# EAGLE design main_board (EAGLE 9.6.2)
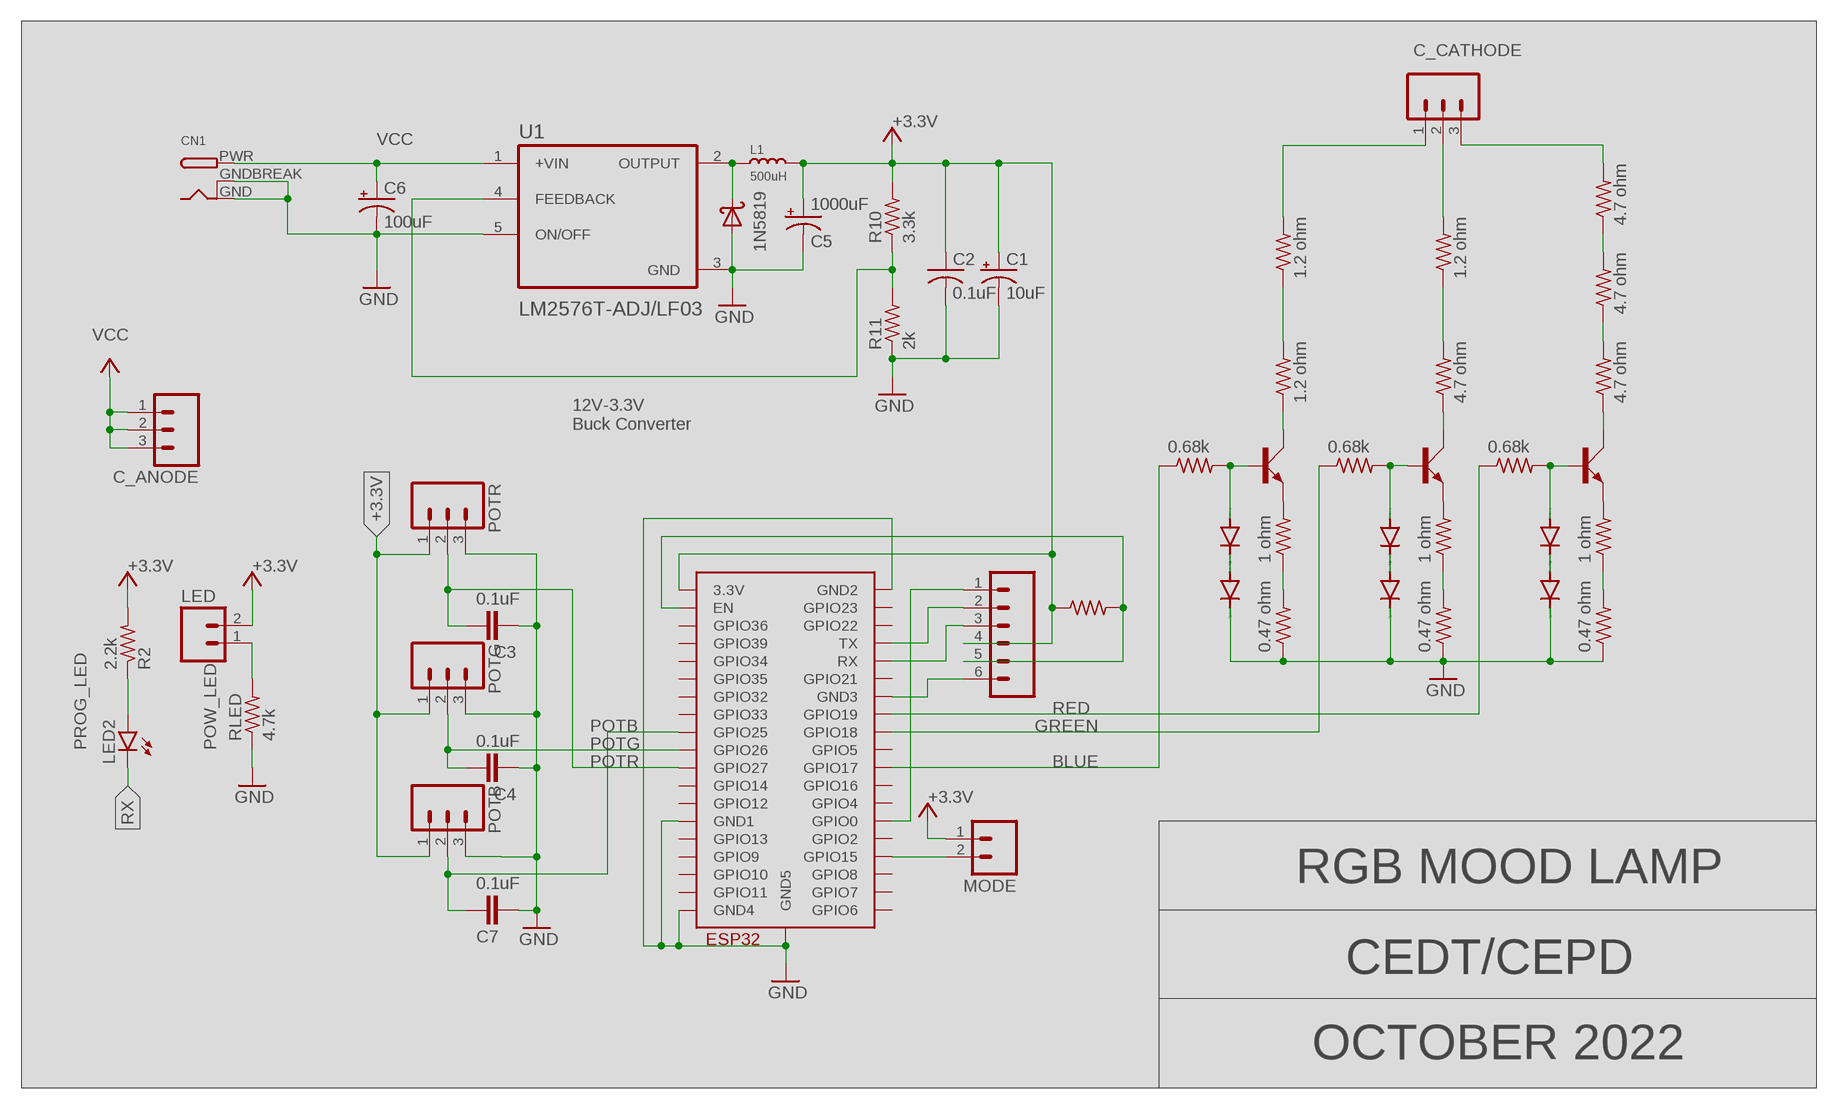
[diagram p0: schematic, sheet 1]

## Parts
C1  10uF  CAP_POL_16V  [B/3528-21R]
C2  0.1uF  CAP0603  [C0603]
C3  0.1uF  C2,5-3  [C2.5-3]
C4  0.1uF  C2,5-3  [C2.5-3]
C5  1000uF  CAPACITOR-PE3.5-8  [E3,5-8]
C6  100uF  CAPACITOR-PE3.5-8  [E3,5-8]
C7  0.1uF  C2,5-3  [C2.5-3]
C_ANODE  M03  [03P]
C_CATHODE  M03  [03P]
CN1  DCBARRELPTH  [DCJACK_2MM_PTH]
D11  1N5819  [DO41-10]
DB1  1N4004  [DO41-10]
DB2  1N4004  [DO41-10]
DG1  1N4004  [DO41-10]
DG2  1N4004  [DO41-10]
DR1  1N4004  [DO41-10]
DR2  1N4004  [DO41-10]
ESP32_MODULE  ESP32-WROOM  [ESP32-WROOM]
L1  500uH  INDUCTOR_INDUCTOR/FERRITE-BEAD6X8H  [INDUCTOR_INT2-3.5-D6.5XH8.0MM]
LED  M02  [02P]
LED2  LED-RED0603  [0603-RED]
MODE  M02  [02P]
POTB  M03  [03P]
POTG  M03  [03P]
POTR  M03  [03P]
QB  MJE3055  [TO220AV]
QG  MJE3055  [TO220AV]
QR  MJE3055  [TO220AV]
R1  10k  RESISTOR0805  [R0805]
R2  2.2k  RESISTOR0805  [R0805]
R10  3.3k  RESISTOR0207/7  [0207/7]
R11  2k  RESISTOR0207/7  [0207/7]
RB_B  0.68k  RESISTOR0207/7  [0207/7]
RB_G  0.68k  RESISTOR0207/7  [0207/7]
RB_R  0.68k  RESISTOR0207/7  [0207/7]
RC_B  1.2 ohm  RESISTOR0207/10  [0207/15]
RC_B1  1.2 ohm  RESISTOR0207/10  [0207/15]
RC_G  1.2 ohm  RESISTOR0207/10  [0207/15]
RC_G1  4.7 ohm  RESISTOR0207/10  [0207/15]
RC_R  4.7 ohm  RESISTOR0207/10  [0207/15]
RC_R1  4.7 ohm  RESISTOR0207/10  [0207/15]
RC_R2  4.7 ohm  RESISTOR0207/10  [0207/15]
RE_B  1 ohm  RESISTOR0207/10  [0207/15]
RE_B1  0.47 ohm  RESISTOR0207/10  [0207/15]
RE_G  1 ohm  RESISTOR0207/10  [0207/15]
RE_G1  0.47 ohm  RESISTOR0207/10  [0207/15]
RE_R  1 ohm  RESISTOR0207/10  [0207/15]
RE_R1  0.47 ohm  RESISTOR0207/10  [0207/15]
RLED  4.7k  RESISTOR0207/7  [0207/7]
SL2  M06  [06P]
U1  LM2576T-ADJ/LF03  [TO170P1016X470X2092-5]

## Nets
+3.3V: C1.+ C2.1 C5.+ ESP32_MODULE.3V3(3.3V) L1.2 LED.2 MODE.1 POTB.1 POTG.1 POTR.1 R1.1 R2.2 R10.2 SL2.4 ; supply symbol labelled VCC
BLUE: ESP32_MODULE.IO17(GPIO17) RB_B.1
ENABLE: ESP32_MODULE.EN R1.2 SL2.5
FB: R10.1 R11.2 U1.4(FEEDBACK)
GND: C1.- C2.2 C3.1 C4.1 C5.- C6.- C7.1 CN1.GND CN1.GNDBREAK D11.A DB2.C DG2.C DR2.C ESP32_MODULE.GND1 ESP32_MODULE.GND2 ESP32_MODULE.GND3 ESP32_MODULE.GND4 ESP32_MODULE.GND5 POTB.3 POTG.3 POTR.3 R11.1 RE_B1.1 RE_G1.1 RE_R1.1 RLED.1 SL2.6 U1.3(GND) U1.5(ON/OFF)
GREEN: ESP32_MODULE.IO18(GPIO18) RB_G.1
MODE: ESP32_MODULE.IO15(GPIO15) MODE.2
N$1: DB1.A QB.B RB_B.2
N$2: QB.E RE_B.2
N$3: C_CATHODE.3 RC_R.2
N$4: LED2.A R2.1
N$5: QG.E RE_G.2
N$6: QR.E RE_R.2
N$7: ESP32_MODULE.IO0(GPIO0) SL2.1
N$13: C_CATHODE.1 RC_B.2
N$14: C_CATHODE.2 RC_G.2
N$17: QB.C RC_B1.1
N$18: RE_B1.2 RE_B.1
N$19: RE_G1.2 RE_G.1
N$20: RC_G1.2 RC_G.1
N$21: RE_R1.2 RE_R.1
N$22: DR1.C DR2.A
N$23: DR1.A QR.B RB_R.2
N$24: LED.1 RLED.2
N$25: DG1.A QG.B RB_G.2
N$26: RC_B1.2 RC_B.1
N$27: DG1.C DG2.A
N$29: RC_R1.2 RC_R.1
N$30: RC_R1.1 RC_R2.2
N$31: QG.C RC_G1.1
N$32: QR.C RC_R2.1
N$33: DB1.C DB2.A
O/P: D11.C L1.1 U1.2(OUTPUT)
POTB: C7.2 ESP32_MODULE.IO25(GPIO25) POTB.2
POTG: C4.2 ESP32_MODULE.IO26(GPIO26) POTG.2
POTR: C3.2 ESP32_MODULE.IO27(GPIO27) POTR.2
RED: ESP32_MODULE.IO19(GPIO19) RB_R.1
RX: ESP32_MODULE.RX LED2.C SL2.3
TX: ESP32_MODULE.TX SL2.2
VCC [POWER]: C6.+ C_ANODE.1 C_ANODE.2 C_ANODE.3 CN1.PWR U1.1(+VIN) ; supply symbol labelled 12V
Unconnected: ESP32_MODULE.CLK(GPIO6) ESP32_MODULE.CMD(GPIO11) ESP32_MODULE.IO2(GPIO2) ESP32_MODULE.IO4(GPIO4) ESP32_MODULE.IO5(GPIO5) ESP32_MODULE.IO12(GPIO12) ESP32_MODULE.IO13(GPIO13) ESP32_MODULE.IO14(GPIO14) ESP32_MODULE.IO16(GPIO16) ESP32_MODULE.IO21(GPIO21) ESP32_MODULE.IO22(GPIO22) ESP32_MODULE.IO23(GPIO23) ESP32_MODULE.IO32(GPIO32) ESP32_MODULE.IO33(GPIO33) ESP32_MODULE.IO34(GPIO34) ESP32_MODULE.IO35(GPIO35) ESP32_MODULE.SD0(GPIO7) ESP32_MODULE.SD1(GPIO8) ESP32_MODULE.SD2(GPIO9) ESP32_MODULE.SD3(GPIO10) ESP32_MODULE.SENSOR_VN(GPIO39) ESP32_MODULE.SENSOR_VP(GPIO36)

## Notes on the sheet
- 12V-3.3V
  Buck Converter
- PROG_LED | POW_LED
- RGB MOOD LAMP
- CEDT/CEPD
- OCTOBER 2022

## Library data of the parts
C1 = CEDT_JANUARY_2015_v6:CAP_POL
C2 = CEDT_JANUARY_2015_v6:CAP
C3 C4 C7 = capacitor-wima:C: CAPACITOR naming: grid - package width
C5 C6 = BeagleBone_Blue_R3:CAPACITOR-P: POLARIZED CAPACITOR, American symbol
C_ANODE C_CATHODE POTB POTG POTR = con-amp-quick:M03: AMP QUICK CONNECTOR; OC_FARNELL: unknown; OC_NEWARK: unknown
CN1 = adafruit:DCBARREL: 2.0mm DC Barrel Jack DCJACK_2MM_PTH - Through Hole Jack (4UConnector: 05537)
D11 = CEDT_JANUARY_2015_v6:1N5819: DIODE general purpose rectifier, 1 A
DB1 DB2 DG1 DG2 DR1 DR2 = diode:1N4004: DIODE general purpose rectifier, 1 A
ESP32_MODULE = ESP32:ESP32-WROOM
L1 = BeagleBone_Blue_R3:INDUCTOR_INDUCTOR/FERRITE-BEAD
LED MODE = CEDT_JANUARY_2015_v6:M02: AMP QUICK CONNECTOR
LED2 = BeagleBone_Blue_R3:LED-RED
QB QG QR = transistor-power:MJE3055: NPN TRANSISTOR
R1 R2 R10 R11 RB_B RB_G RB_R RC_B RC_B1 RC_G RC_G1 RC_R RC_R1 RC_R2 RE_B RE_B1 RE_G RE_G1 RE_R RE_R1 RLED = CEDT_JANUARY_2015_v6:RESISTOR
SL2 = con-amp-quick:M06: AMP QUICK CONNECTOR; OC_FARNELL: unknown; OC_NEWARK: unknown
U1 = LM2576T-ADJ_LF03:LM2576T-ADJ/LF03: None Check availability <https://pricing.snapeda.com/parts/LM2576T-ADJ/LF03/Texas%20Instruments/view-part?ref=eda>; AVAILABILITY: In Stock; DESCRIPTION: SIMPLE SWITCHER&reg; 40V, 3A Low Component Count Step-Down Regulator; MF: Texas Instruments; MP: LM2576T-ADJ/LF03; PACKAGE: TO-220-5 Texas Instruments; PRICE: None; PURCHASE-URL: https://pricing.snapeda.com/search/part/LM2576T-ADJ/LF03/?ref=eda

## Net classes
1 POWER: width 0.711 mm, drill 0.7 mm, clearance 0.25 mm

## Board
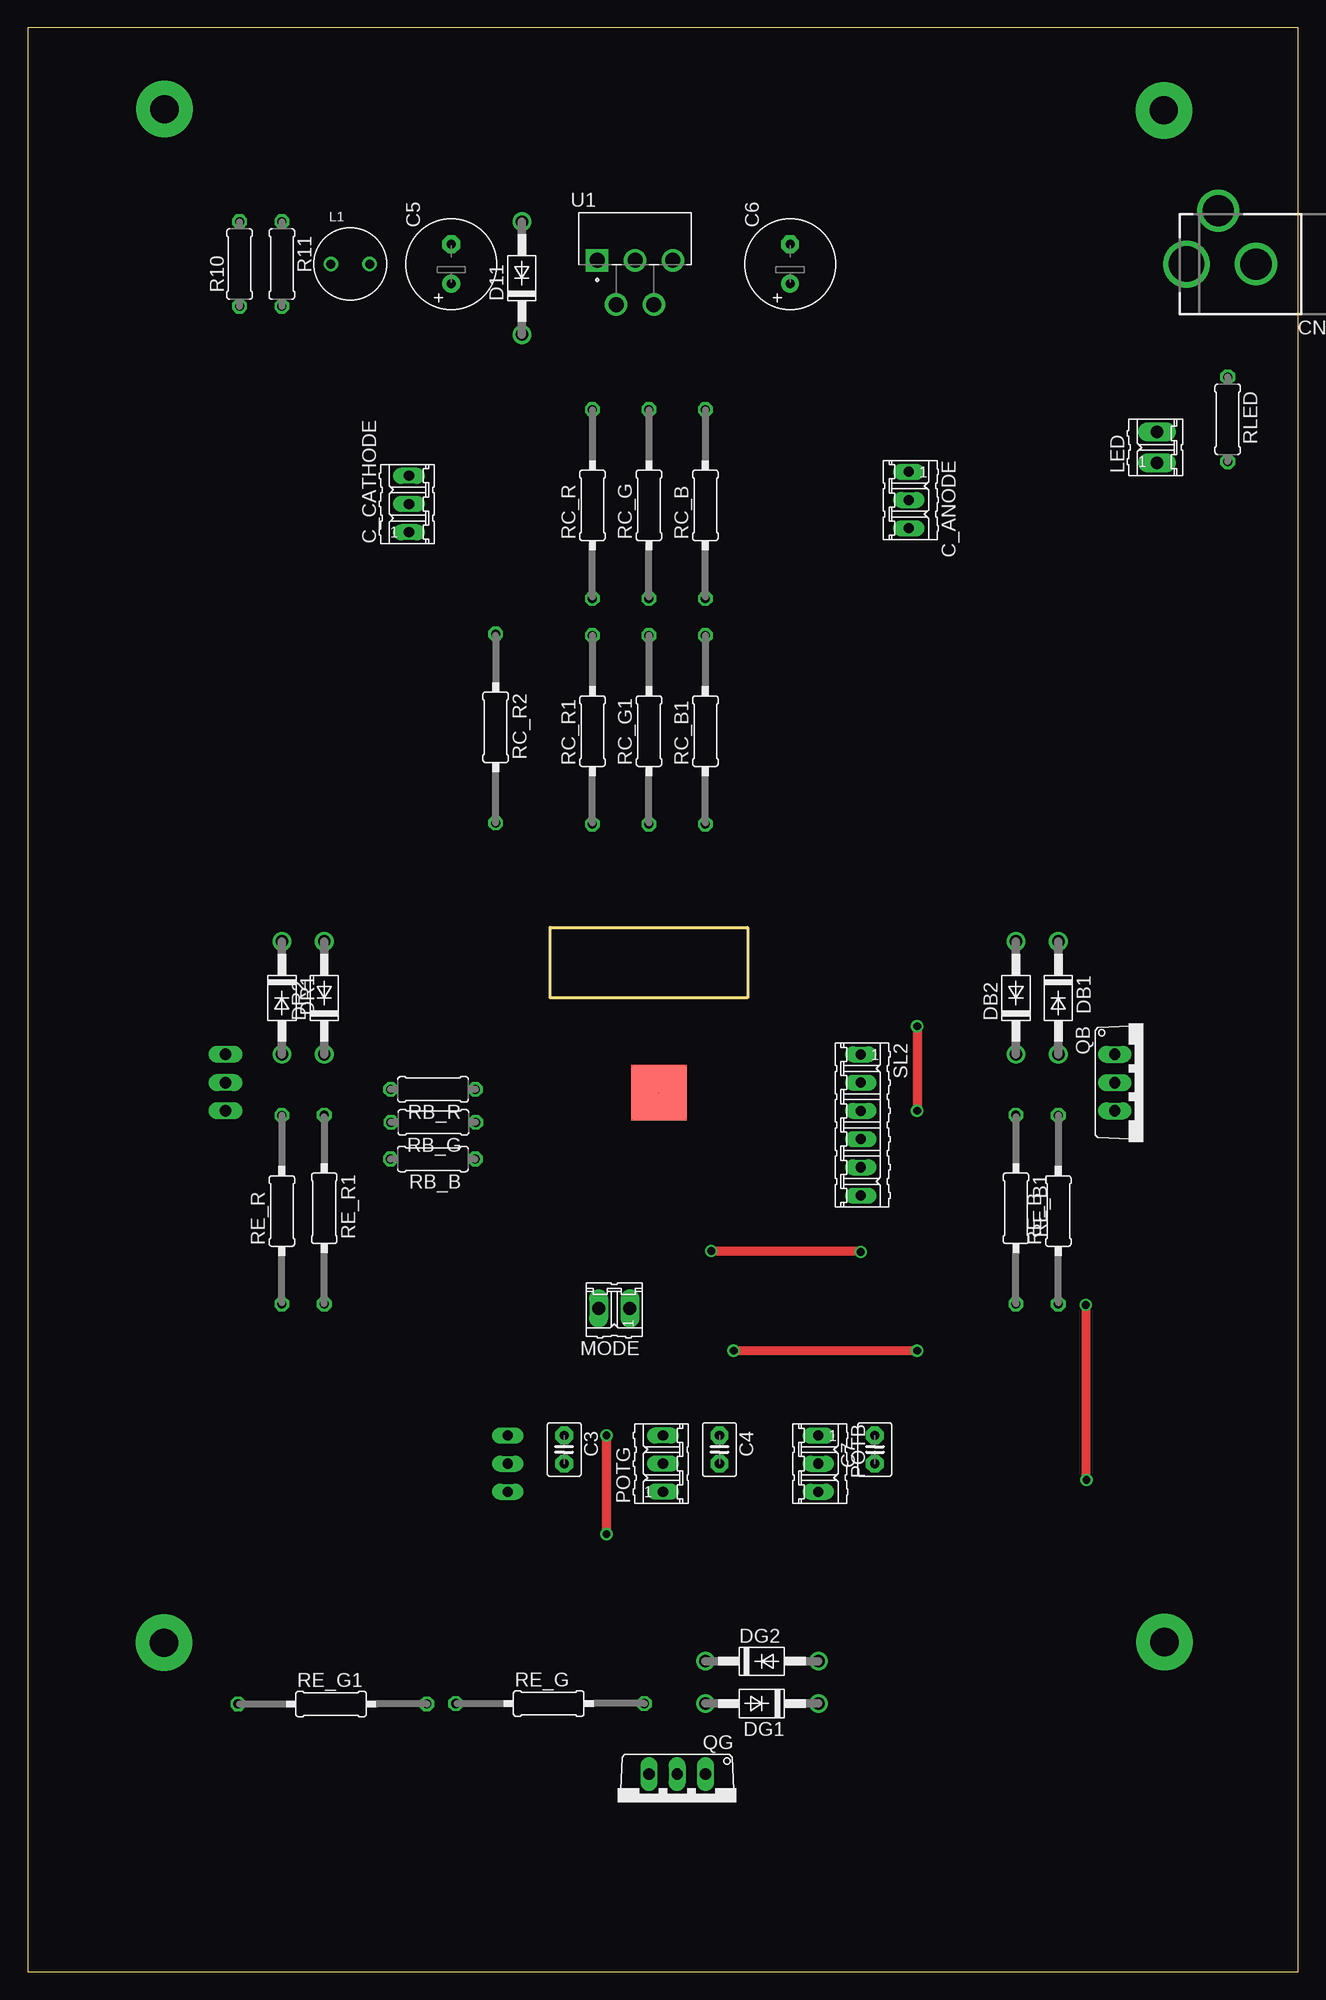
[diagram p1: board, top side]
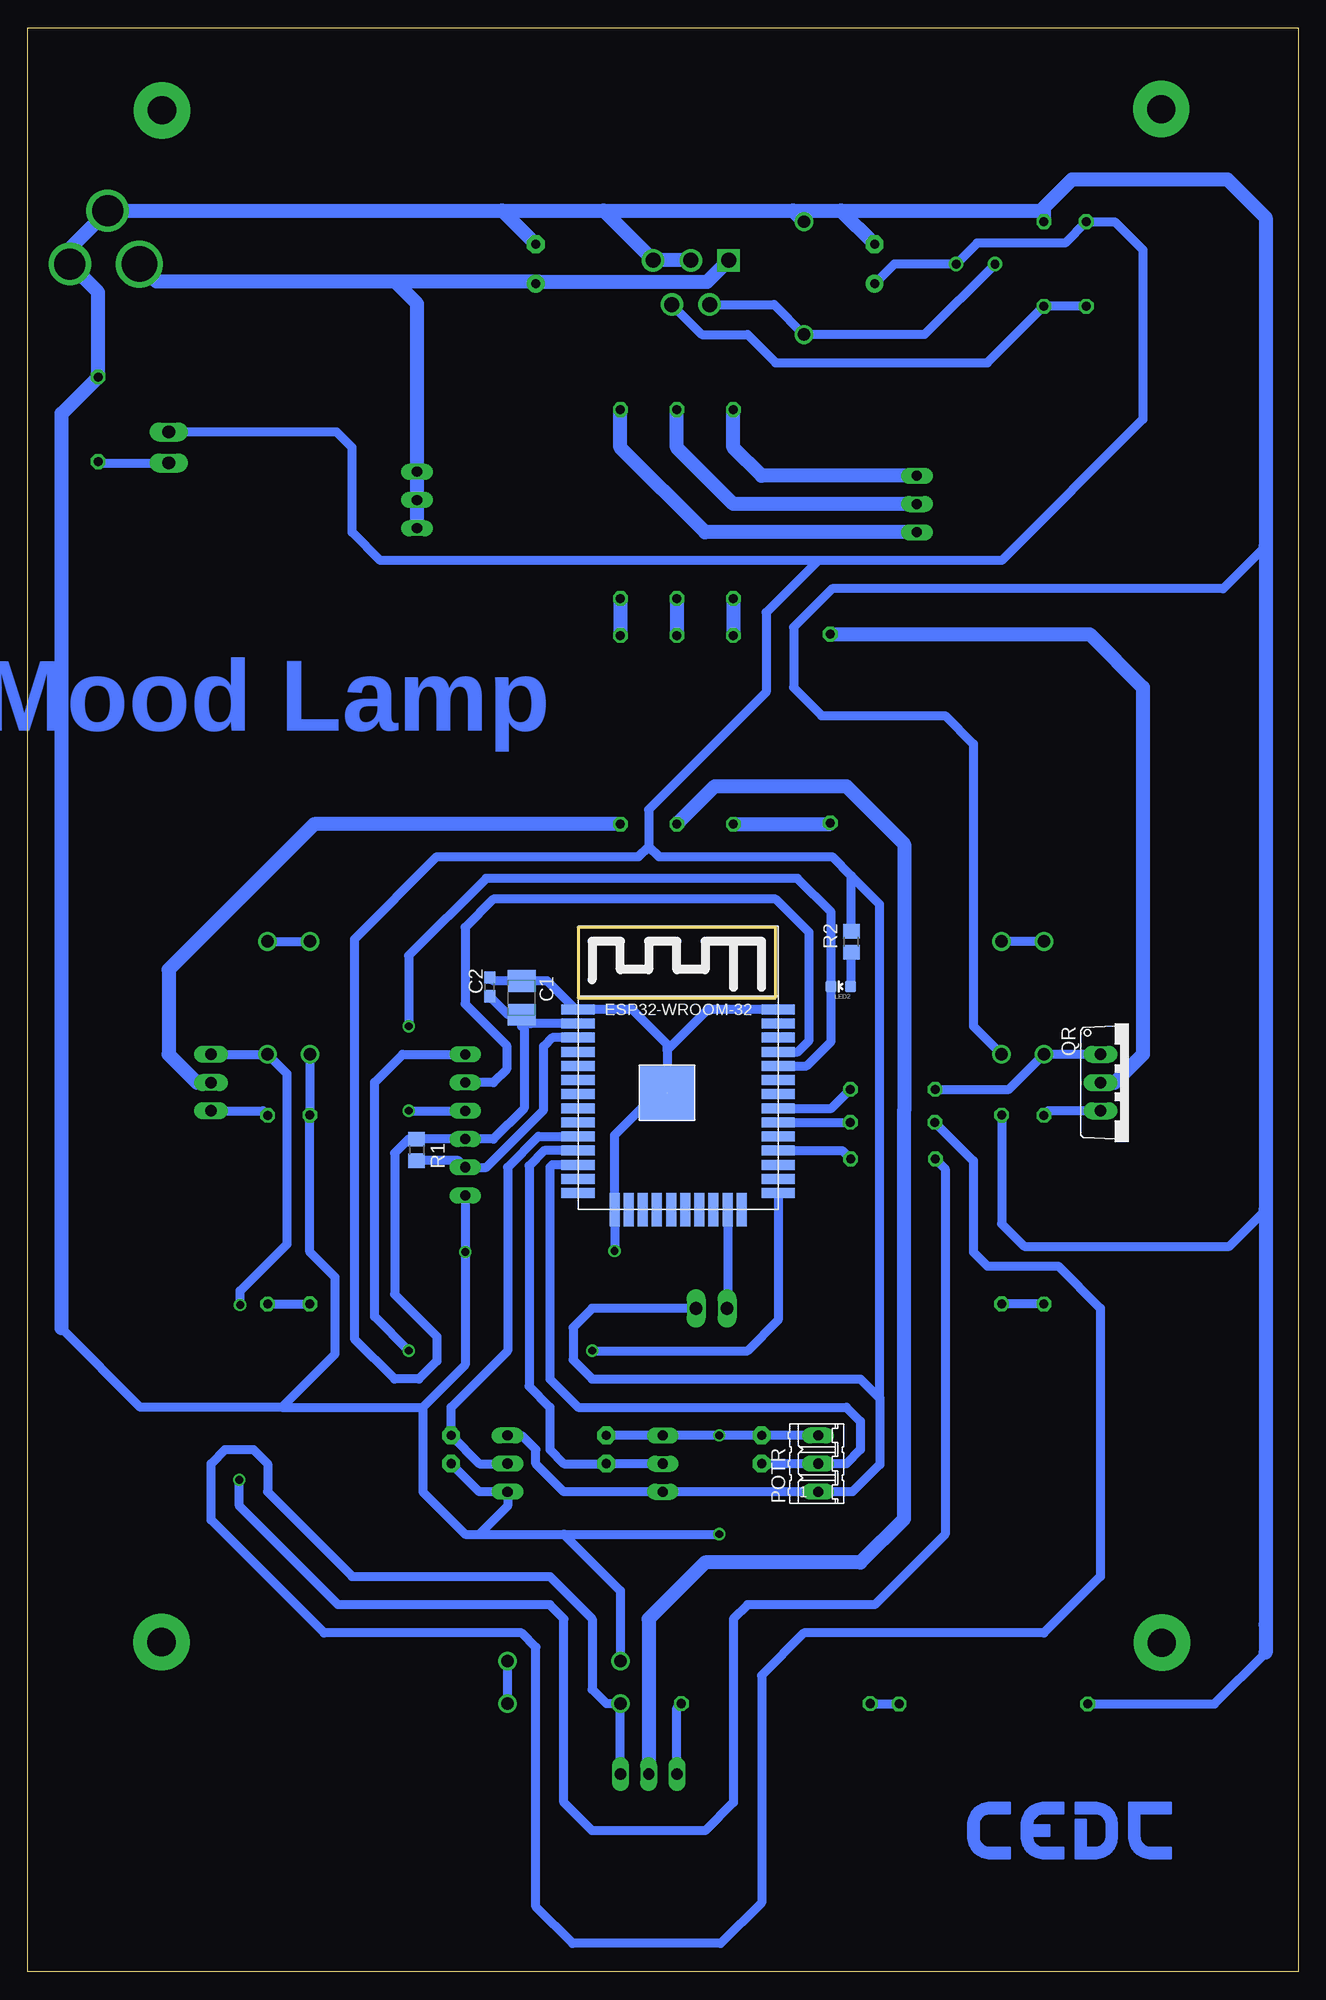
[diagram p2: board, bottom side, seen from below]

Size 114.28 x 174.93 mm. Coordinates in mm from the lower left corner, seen from the top.
Outline: 0,0 114.28,0 114.28,174.93 0,174.93 0,0
Outline: 46.99,93.98 64.77,93.98 64.77,87.63 46.99,87.63 46.99,93.98
Copper layers (1*16): Top 0.035mm / dielectric 1.5mm / Bottom 0.035mm
Design rules "default *": minimum track width 6mil, minimum drill 0.35mm, track to track 12mil, track to pad 12mil, pad to pad 12mil, via to via 12mil, smd to smd 12mil, copper to edge 40mil, drill to drill 6mil, minimum pad ring 10mil, minimum via ring 8mil, stop-mask expansion 4mil, vias tented up to drill 0mil, thermal gap 10mil

### Footprints (pad centres in the part's own frame; a part is rotated, then mirrored left to right if it is on the bottom)
B/3528-21R = smd 1.95 x 2.5: + 1.525,0; - -1.525,0
C0603 = smd 1.1 x 1: 1 -0.85,0; 2 0.85,0
C2.5-3 = drill 0.813 pad 1.6 octagon: 1 -1.27,0; 2 1.27,0
E3,5-8 = drill 0.813 pad 1.6: + -1.778,0 | drill 0.813 pad 1.6 octagon: - 1.778,0
03P = drill 0.914 long: 1 -2.54,0; 2 0,0; 3 2.54,0
DCJACK_2MM_PTH = drill 2.8: GND 0,7.35; GNDBREAK 4.8,10.75 | drill 3.2: PWR 0,13.6
DO41-10 = drill 1.118: A 5.08,0; C -5.08,0
ESP32-WROOM = smd 3 x 0.9: 3V3 0,16.74; EN 0,15.47; GND1 0,18.01; GND3 18,18.01; IO0 18,1.5; IO4 18,2.77; IO5 18,6.58; IO12 0,1.5; IO14 0,2.77; IO16 18,4.04; IO17 18,5.31; IO18 18,7.85; IO19 18,9.12; IO21 18,11.66; IO22 18,15.47; IO23 18,16.74; IO25 0,6.58; IO26 0,5.31; IO27 0,4.04; IO32 0,9.12; IO33 0,7.85; IO34 0,11.66; IO35 0,10.39; NC 18,10.39; RX 18,12.93; SENSOR_VN 0,12.93; SENSOR_VP 0,14.2; TX 18,14.2 | smd 0.9 x 3: CLK 9.635,0; CMD 8.365,0; GND2 3.285,0; IO2 14.715,0; IO13 4.555,0; IO15 13.445,0; SD0 10.905,0; SD1 12.175,0; SD2 5.825,0; SD3 7.095,0 | smd 5 x 5: GND4 8,10.5 | smd 5 x 5 bottom: GND5 8,10.5
INDUCTOR_INT2-3.5-D6.5XH8.0MM = drill 0.8: 1 -1.75,0; 2 1.75,0
02P = drill 1.143 long: 1 -1.397,0; 2 1.397,0
0603-RED = smd 1 x 1: A 0,-0.877; C 0,0.877
TO220AV = drill 1.016 long: B -2.54,-2.54; C 0,-2.54; E 2.54,-2.54
R0805 = smd 1.3 x 1.5: 1 -0.95,0; 2 0.95,0
0207/7 = drill 0.813 octagon: 1 -3.81,0; 2 3.81,0
0207/15 = drill 0.813 octagon: 1 -8.5,0; 2 8.486,0
06P = drill 0.914 long: 1 -6.35,0; 2 -3.81,0; 3 -1.27,0; 4 1.27,0; 5 3.81,0; 6 6.35,0
TO170P1016X470X2092-5 = drill 1.35 square: 1 0,0 | drill 1.35: 2 1.7,-4; 3 3.4,0; 4 5.1,-4; 5 6.8,0

### Placement (x,y rotation side)
C1  69.85,87.63 270 bottom
C2  72.71,88.63 90 bottom
C3  48.26,46.99 270 top
C4  62.23,46.99 270 top
C5  38.1,153.67 90 top
C6  68.58,153.67 90 top
C7  76.2,46.99 90 top
C_ANODE  79.26,132.43 270 top
C_CATHODE  34.29,132.08 90 top
CN1  117.85,153.67 90 top
D11  44.45,152.4 90 top
DB1  92.71,87.63 270 top
DB2  88.9,87.63 90 top
DG1  66.04,24.13 180 top
DG2  66.04,27.94 0 top
DR1  22.86,87.63 270 top
DR2  26.67,87.63 90 top
ESP32_MODULE  64.77,68.58 0 bottom
L1  29.01,153.67 0 top
LED  101.6,137.16 90 top
LED2  41.14,88.67 90 bottom
MODE  52.76,59.69 180 top
POTB  71.12,45.72 270 top
POTG  57.15,45.72 90 top
POTR  43.18,45.72 90 bottom
QB  100.33,80.01 270 top
QG  58.42,15.24 180 top
QR  15.24,80.01 270 bottom
R1  79.3,73.95 270 bottom
R2  40.18,92.69 90 bottom
R10  19.05,153.67 90 top
R11  22.86,153.67 270 top
RB_B  36.44,73.13 180 top
RB_G  36.48,76.43 180 top
RB_R  36.46,79.4 180 top
RC_B  60.96,132.08 90 top
RC_B1  60.96,111.76 90 top
RC_G  55.88,132.08 90 top
RC_G1  55.88,111.76 90 top
RC_R  50.8,132.08 90 top
RC_R1  50.8,111.76 90 top
RC_R2  42.09,111.86 270 top
RE_B  92.71,68.58 90 top
RE_B1  88.9,68.58 270 top
RE_G  46.99,24.13 0 top
RE_G1  27.41,24.09 0 top
RE_R  22.86,68.58 90 top
RE_R1  26.67,68.58 270 top
RLED  107.95,139.7 270 top
SL2  74.93,76.2 270 top
U1  51.23,154.01 0 top
U$1  [LOGO-CEDT-BOT-18MM]  11.43,10.16 0 top

### Tracks (layer width: path | path; a pad name or v marks a point on that pad's centre or on a via)
+3.3V
  Bottom 0.813: C5.+ 36.32,153.67 L1.2 28.86,155.57 20.96,155.57 R10.2 16.51,157.48 13.97,154.94 13.97,139.7 26.67,127 43.18,127 | ESP32_MODULE.3V3 69.06,85.32 C1.+ | C1.+ 71.04,86.11 C2.1 | 43.18,127 82.55,127 85.09,129.54 85.09,137.16 86.49,138.56 LED.2 | MODE.1 63.5,59.69 65.22,57.97 65.22,55.07 63.5,53.34 39.37,53.34 37.66,51.63 | 37.66,51.63 37.63,51.6 37.63,45.65 40.1,43.18 POTR.1 POTG.1 66.04,43.18 68.58,45.72 68.58,46.99 69.85,48.26 POTB.1 | C1.+ 69.85,85.09 69.62,84.86 69.62,77.7 72.39,74.93 SL2.4 79.27,74.93 R1.1 80.04,74.9 81.28,73.66 81.28,60.96 77.47,57.15 77.47,54.96 79.09,53.34 81.28,53.34 84.9,56.96 84.9,92.9 77.47,100.33 59.35,100.33 58.42,101.26 | 43.18,127 47.86,122.32 47.86,115.13 58.42,104.57 58.42,101.26 | 37.66,51.63 37.66,96.08 40.18,98.6 | 40.18,98.6 41.91,100.33 57.49,100.33 58.42,101.26 | R2.2 40.18,98.6
BLUE
  Bottom 0.813: ESP32_MODULE.IO17 41.01,73.89 RB_B.1
ENABLE
  Bottom 0.813: R1.2 75.54,73 SL2.5 73.03,72.39 67.86,77.55 67.86,83.27 67.08,84.05 ESP32_MODULE.EN
FB
  Bottom 0.813: R10.1 R11.2 27.94,144.78 46.99,144.78 49.53,147.32 53.64,147.32 U1.4
GND  (via drill 0.7)  (1 unrouted)
  Top 0.813: v61.49,64.86 74.93,64.86 v74.93,64.77 | v52.07,39.37 v52.07,48.26
  Bottom 0.813: C2.2 72.39,89.16 C1.- 67.56,89.16 65,86.59 ESP32_MODULE.GND1 59.92,86.59 56.77,83.44 56.77,82.93 | ESP32_MODULE.GND3 53.11,86.59 56.77,82.93 | 56.77,82.93 56.77,80.01 | ESP32_MODULE.GND4 56.77,80.01 | 56.77,80.01 61.48,75.3 ESP32_MODULE.GND2 61.48,64.93 61.45,64.9 v61.49,64.86 | POTR.3 C3.1 v52.07,48.26 POTG.3 C4.1 | 2.92,128.27 6.73,124.46 41.91,124.46 45.39,120.98 45.39,115.57 42.85,113.03 31.75,113.03 29.21,110.49 29.21,85.09 DR2.C | SL2.6 v74.93,64.77 74.93,54.61 78.74,50.8 | 91.44,50.8 78.74,50.8 | 91.44,50.8 104.14,50.8 111.24,57.9 | DB2.C RE_B1.1 88.9,64.77 86.63,62.5 86.63,55.61 91.44,50.8 | 73.66,39.37 74.93,39.37 78.74,43.18 78.74,50.8 | 73.66,39.37 66.04,39.37 | 66.04,39.37 60.96,34.29 DG2.C | 66.04,39.37 v52.07,39.37 | 2.92,28.71 7.54,24.09 RE_G1.1 | RE_R1.1 26.67,67.31 24.63,65.27 6.18,65.27 2.92,68.53 2.92,68.58 | C7.1 73.66,43.18 POTB.3 71.12,41.91 73.66,39.37
  Bottom 1.27: 71.6,158.47 CN1.GNDBREAK 110.5,155.07 CN1.GND 107.95,151.12 RLED.1 111.24,140.22 111.24,57.9 | 71.6,158.47 62.49,158.47 | 62.49,158.47 45.44,158.47 | 45.44,158.47 41.12,158.47 | 41.12,158.47 23.14,158.47 | 23.14,158.47 22.86,158.47 R11.1 | D11.A 45.44,158.47 | C6.- 71.6,158.47 | C5.- 41.12,158.47 | U1.3 U1.5 62.49,158.47 | 23.14,158.47 20.32,161.29 6.35,161.29 2.92,157.86 2.92,128.27 2.92,68.58 2.92,31.25 | 2.92,31.25 2.92,28.71 | 2.92,31.25 2.9,31.23
GREEN
  Bottom 0.813: ESP32_MODULE.IO18 RB_G.1
MODE
  Bottom 0.813: ESP32_MODULE.IO15 51.32,59.73 MODE.2
N$1  (via drill 0.7)
  Top 0.813: v95.18,60 95.18,44.33 v95.25,44.25
  Bottom 0.813: QB.B DB1.A 90.95,80.8 90.95,65.48 95.18,61.27 v95.18,60 | RB_B.2 31.75,72.25 31.75,39.37 38.1,33.02 49.53,33.02 50.8,31.75 50.8,15.24 53.34,12.7 63.5,12.7 66.04,15.24 66.04,31.75 67.31,33.02 86.36,33.02 95.25,41.91 v95.25,44.25
N$2
  Bottom 0.813: QB.E 93.11,77.47 RE_B.2
N$3
  Bottom 1.27: C_CATHODE.3 48.26,134.62 50.8,137.16 RC_R.2
N$4
  Bottom 0.813: LED2.A 40.22,88.71 R2.1
N$5
  Bottom 0.813: QG.E 55.88,23.73 RE_G.2
N$6
  Bottom 0.813: QR.E 22.46,77.47 RE_R.2
N$7  (via drill 0.7)
  Top 0.813: v80.01,55.88 v63.5,55.88
  Bottom 0.813: ESP32_MODULE.IO0 46.77,58.64 49.53,55.88 v63.5,55.88 | v80.01,55.88 83.08,58.95 83.08,80.03 80.56,82.55 SL2.1
N$8  (via drill 2.54 pad 5.08)
  other vias: 12.31,167.61
N$9  (via drill 2.54 pad 5.08)
  other vias: 102.2,167.51
N$10  (via drill 2.54 pad 5.08)
  other vias: 102.26,29.67
N$11  (via drill 2.54 pad 5.08)
  other vias: 12.26,29.6
N$13
  Bottom 1.27: C_CATHODE.1 53.34,129.54 60.96,137.16 RC_B.2
N$14
  Bottom 1.27: C_CATHODE.2 50.8,132.08 55.88,137.16 RC_G.2
N$17
  Bottom 1.27: RC_B1.1 88.51,103.26 101.6,90.17 101.6,82.55 99.06,80.01 QB.C
N$18
  Bottom 0.813: RE_B.1 88.91,60.08 RE_B1.2
N$19
  Bottom 0.813: RE_G.1 38.45,24.09 RE_G1.2
N$20
  Bottom 1.27: RC_G.1 RC_G1.2
N$21
  Bottom 0.813: RE_R.1 26.66,60.08 RE_R1.2
N$22
  Bottom 0.813: DR1.C DR2.A
N$23
  Bottom 0.813: QR.B DR1.A 26.01,79.4 RB_R.2
N$24
  Bottom 0.813: RLED.2 107.82,135.76 LED.1
N$25
  Bottom 0.813: QG.B DG1.A 62.23,24.13 63.5,25.4 63.5,31.75 67.31,35.56 85.09,35.56 92.71,43.18 92.71,45.72 93.98,46.99 96.52,46.99 97.79,45.72 97.79,40.64 87.63,30.48 69.85,30.48 68.58,29.21 68.58,5.85 65.27,2.54 51.95,2.54 48.26,6.23 48.26,26.67 44.45,30.48 22.86,30.48 17.78,35.56 17.78,59.69 21.59,63.5 27.94,63.5 29.21,64.77 29.21,72.97 RB_G.2
N$26
  Bottom 1.27: RC_B.1 RC_B1.2
N$27
  Bottom 0.813: DG1.C DG2.A
N$29
  Bottom 1.27: RC_R.1 RC_R1.2
N$30
  Bottom 1.27: RC_R2.2 42.21,103.26 RC_R1.1
N$31
  Bottom 1.27: RC_G1.1 52.46,106.68 40.64,106.68 35.44,101.48 35.44,77.47 | QG.C 58.42,31.75 53.34,36.83 39.37,36.83 35.44,40.76 35.44,77.47 | 35.44,77.47
N$32
  Bottom 1.27: RC_R2.1 18.76,120.36 13.97,115.57 13.97,82.55 16.51,80.01 QR.C
N$33
  Bottom 0.813: DB1.C DB2.A
O/P
  Bottom 0.813: U1.2 47.14,150.01 D11.C 33.61,147.32 L1.1
POTB
  Bottom 0.813: ESP32_MODULE.IO25 68.35,75.16 71.12,72.39 71.12,55.88 76.2,50.8 C7.2 73.66,45.72 POTB.2
POTG
  Bottom 0.813: ESP32_MODULE.IO26 67.82,73.89 69.19,72.52 69.19,52.68 67.31,50.8 67.31,46.99 66.04,45.72 C4.2 POTG.2
POTR
  Bottom 0.813: C3.2 POTR.2 40.64,45.72 39.37,46.99 39.37,49.53 40.64,50.8 64.77,50.8 67.31,53.34 67.31,72.39 67.08,72.62 ESP32_MODULE.IO27
RED
  Bottom 0.813: ESP32_MODULE.IO19 41.98,77.7 RB_R.1
RX  (via drill 0.7)
  Top 0.813: v80.01,85.09 v80.01,77.47
  Bottom 0.813: ESP32_MODULE.RX 44.22,81.51 42.02,83.72 LED2.C 42.02,95.36 45.05,98.39 73.06,98.39 80.01,91.44 v80.01,85.09 | v80.01,77.47 SL2.3
TX
  Bottom 0.813: ESP32_MODULE.TX 45,82.78 43.99,83.8 43.99,93.52 46.99,96.52 72.39,96.52 74.93,93.98 74.93,87.09 71.19,83.36 71.19,81.21 72.39,80.01 SL2.2
VCC
  Bottom 1.27: U1.1 53.19,152.06 68.41,152.06 | 68.41,152.06 68.36,152.12 81.28,152.12 | 68.41,152.06 C6.+ | CN1.PWR 102.69,152.12 81.28,152.12 | C_ANODE.3 C_ANODE.2 C_ANODE.1 79.26,150.1 81.28,152.12

### Text on the board
Bottom: Mood Lamp